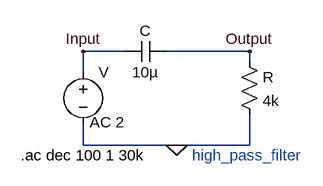
[diagram p0: schematic high_pass_filter.asc]
high_pass_filter.asc, the LTspice schematic file:
Version 4.1
SHEET 1 880 680
WIRE 32 96 -32 96
WIRE 224 96 96 96
WIRE 224 112 224 96
WIRE -32 128 -32 96
WIRE -32 240 -32 208
WIRE 112 240 -32 240
WIRE 224 240 224 192
WIRE 224 240 112 240
FLAG 112 240 0
FLAG -32 96 Input
FLAG 224 96 Output
SYMBOL cap 96 80 R90
WINDOW 0 0 32 VBottom 2
WINDOW 3 32 32 VTop 2
SYMATTR InstName C
SYMATTR Value 10µ
SYMBOL res 208 96 R0
SYMATTR InstName R
SYMATTR Value 4k
SYMBOL voltage -32 112 R0
WINDOW 123 10 93 Left 2
WINDOW 39 0 0 Left 0
SYMATTR Value2 AC 2
SYMATTR InstName V
SYMATTR Value ""
TEXT -128 256 Left 2 !.ac dec 100 1 30k
TEXT 136 256 Left 2 ;high_pass_filter

The netlist it stands for:
* high_pass_filter.asc
C Output Input 10µ
R Output 0 4k
V Input 0 AC 2
.ac dec 100 1 30k
* high_pass_filter
.backanno
.end